# Altium schematic sheet Radio_bug.SchDoc: Наименование
size 209 x 297 mm; ApprovedBy: Утвердил; CheckedBy: Проверил; Author: Разработал; CompanyName: Организация; DrawnBy: Н.Контр; Engineer: Т.Контр; SheetNumber: 3; SheetTotal: 6; PageSetup: Record=PageOptions|CenterHorizontal=True|CenterVertical=True|PrintScale=0.94|XCorrection=1.00|YCorrection=1.00|PrintKind=1|BorderSize=5000000|LeftOffset=0|BottomOffset=0|Orientation=1|PaperLength=1000|PaperWidth=1000|Scale=100|PaperSource=7|PrintQuality=-4|MediaType=1|DitherType=10|PaperKind=A4|PrintScaleMode=1; DecimalNumber: Децимальный номер; HeadOfSector: Нач. сектора; MainDevice: Перв.примен.; Name: Наименование; DocumentName: Sheet1.SCHDOC
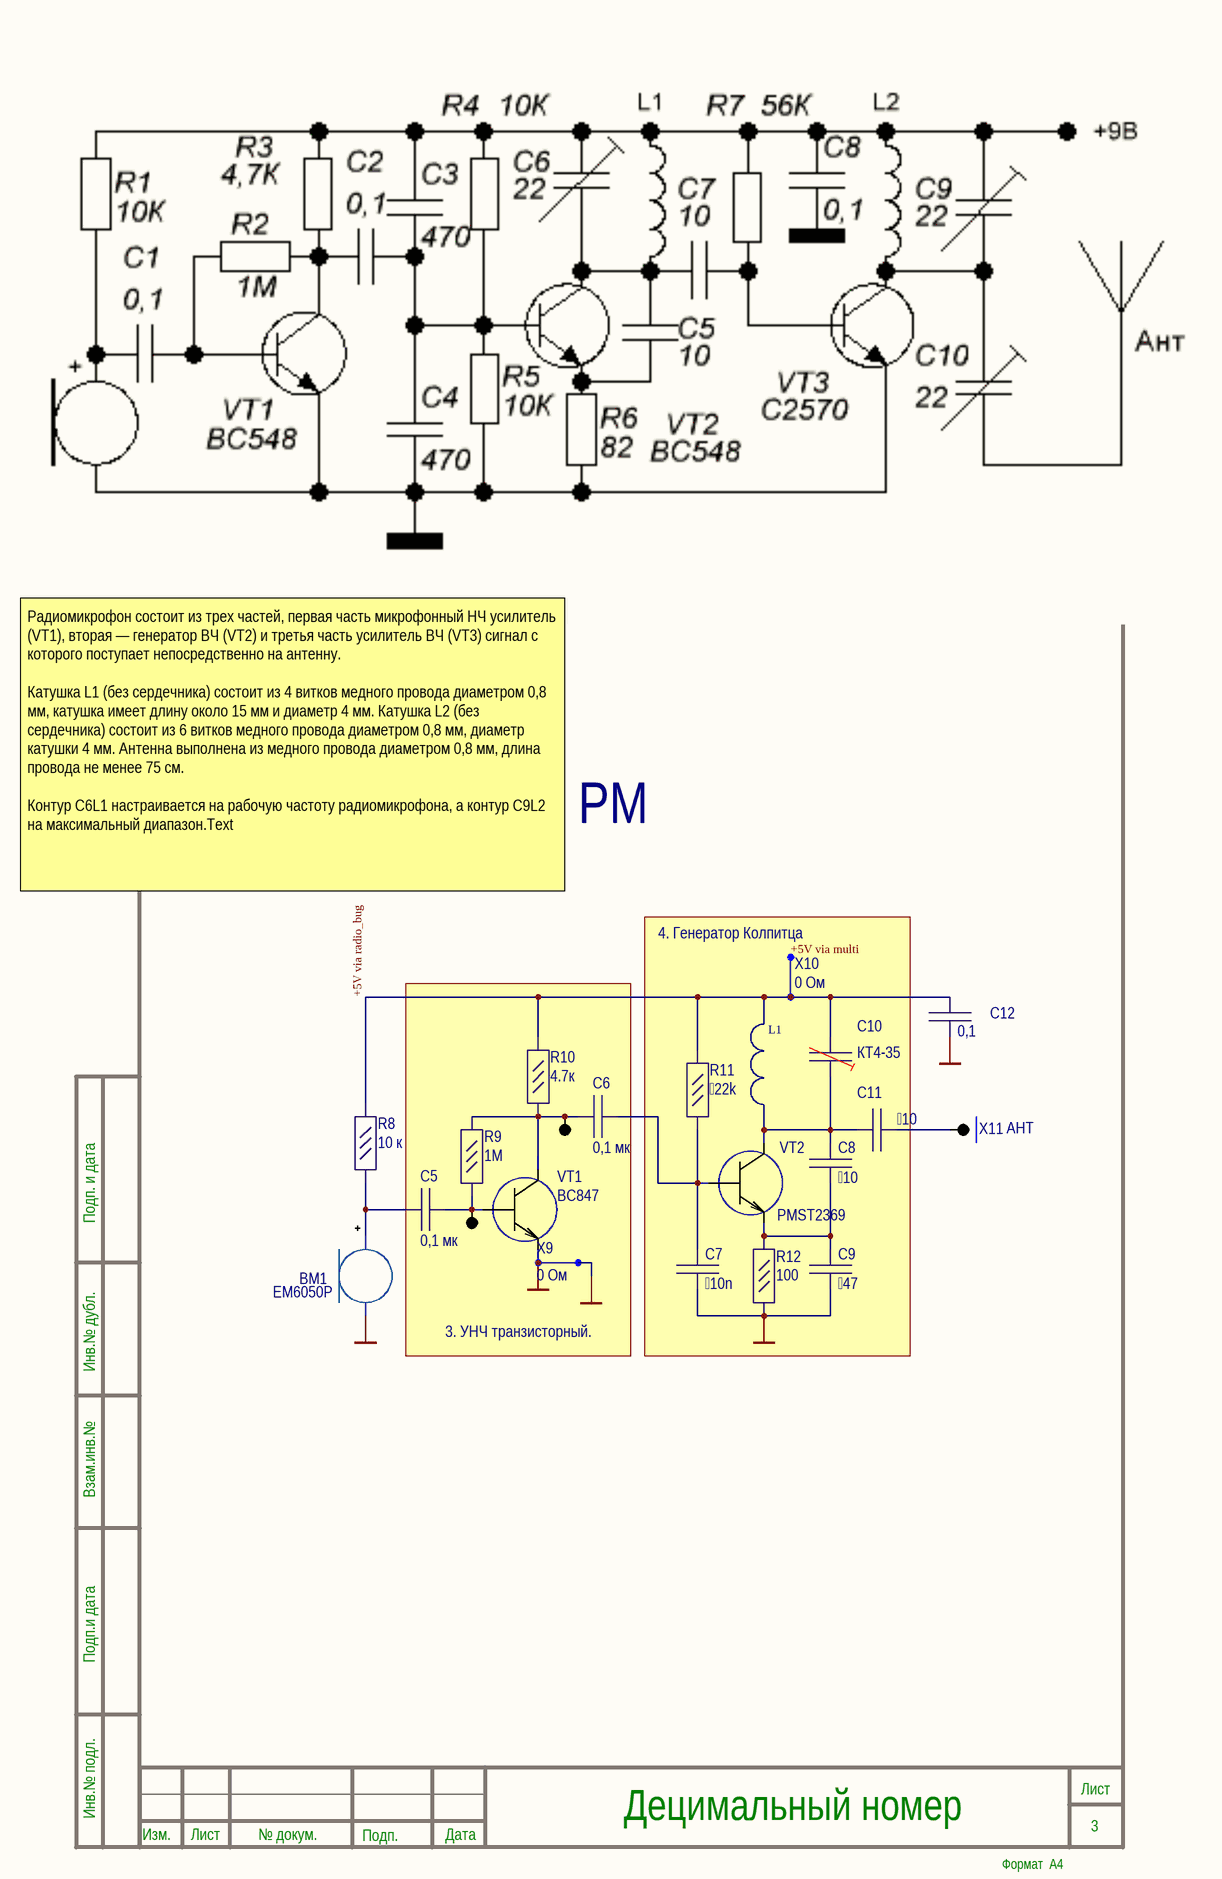
[diagram p0: Radio_bug.SchDoc]

## Parts
BM1  EM6050P  [EM6050P]
C5  0,1 мк  [C_0805]
C6  0,1 мк  [C_0805]
C7  10n  [C_0805]
C8  10  [C_0805]
C9  47  [C_0805]
C10  КТ4-35  [KТ4-35]
C11  10  [C_0805]
C12  0,1  [C_0805]
L1  Inductor  [Inductor]  (value not drawn)
R8  10 к  [R_0805]
R9  1М  [R_0805]
R10  4.7к  [R_0805]
R11  22k  [R_0805]
R12  100  [R_0805]
TP3  Test_Point_1  [PLS-1]  (value not drawn)
TP4  Test_Point_1  [PLS-1]  (value not drawn)
VT1  BC847  [SOT23]
VT2  PMST2369  [SOT-323]
X9  0 Ом  [jumper]
X10  0 Ом  [jumper]
X11  КТ  [PLS-1]  (value not drawn)

## Blocks framed on the sheet
4. Генератор Колпитца: C7-C11 L1 R11 R12 VT2 X10
3. УНЧ транзисторный.: C5 C6 R9 R10 TP3 TP4 VT1 X9

## Nets
GND: BM1.2 C7.2 C9.2 C12.2 R12.2 VT1.2(E) X9.1 X9.2
+5V via multi: X10.2
+5V via radio_bug: C10.1 C12.1 L1.2 R8.1 R10.1 R11.1 X10.1
NetBM1_1: BM1.1 C5.1 R8.2
NetC5_2: C5.2 R9.2 TP3.1 VT1.1(B)
NetC6_1: C6.1 R9.1 R10.2 TP4.1 VT1.3(C)
NetC6_2: C6.2 C7.1 R11.2 VT2.1(B)
NetC8_1: C8.1 C10.2 C11.2 L1.1 VT2.3(C)
NetC8_2: C8.2 C9.1 R12.1 VT2.2(E)
NetC11_1: C11.1 X11.1

## Notes on the sheet
- Радиомикрофон состоит из трех частей, первая часть микрофонный НЧ усилитель (VT1), вторая — генератор ВЧ (VT2) и третья часть усилитель ВЧ (VT3) сигнал с которого поступает непосредственно на антенну.
  Катушка L1 (без сердечника) состоит из 4 витков медного провода диаметром 0,8 мм, катушка имеет длину около 15 мм и диаметр 4 мм. Катушка L2 (без сердечника) состоит из 6 витков медного провода диаметром 0,8 мм, диаметр катушки 4 мм. Антенна выполнена из медного провода диаметром 0,8 мм, длина провода не менее 75 см.
  Контур С6L1 настраивается на рабочую частоту радиомикрофона, а контур С9L2 на максимальный диапазон.Text
- PM
- (near X11) АНТ
- Подп. и дата
- Инв.№ дубл.
- Взам.инв.№
- Подп.и дата
- Инв.№ подл.
- Изм.
- Лист
- № докум.
- Подп.
- Дата
- Формат  A4

## Library data of the parts
C5-C9 C11 C12 = GRM188R72A104KA35D: CAP CER 0.1UF 100V X7R 0603; Manufacturer: Murata Electronics; Value: 0.1µF; Part Number: GRM188R72A104KA35D; ComponentLink1URL: https://www.murata.com/~/media/webrenewal/support/library/catalog/products/capacitor/mlcc/c02e.ashx?la=en-us; ComponentLink1Description: Datasheet; Component Type: Capasitor
R8 = CR0603-FX-1002ELF: RES SMD 10K OHM 1% 1/10W 0603; Manufacturer: Bourns Inc.; Part Number: CR0603-FX-1002ELF; Value: 10 к; ComponentLink1URL: https://www.bourns.com/pdfs/chpreztr.pdf; ComponentLink1Description: Datasheet; Component Type: Resistor
R9-R12 = CR0603-FX-1002ELF: RES SMD 10K OHM 1% 1/10W 0603; Manufacturer: Bourns Inc.; Value: 10 к; Part Number: CR0603-FX-1002ELF; ComponentLink1URL: https://www.bourns.com/pdfs/chpreztr.pdf; ComponentLink1Description: Datasheet; Component Type: Resistor
VT2 = BC847
X9 X10 = 0 Ohm (0805)